# Altium schematic sheet AFE_CTRL_Logic.SchDoc: Shuttler AFE
size 420 x 297 mm; Author: G.Kasprowicz; CompanyName: WUT ISE; DrawnBy: G.Kasprowicz; Organization: WUT ISE; Address1: PW ISE; Address2: Nowowiejska 15/19 00-665 Warsaw; Address3: gkasprow@gmail.com; DocumentNumber: 3; SheetNumber: 3; SheetTotal: 6; ModifiedBy: -; CheckedDate: -; Title2: Control & logic; DivGrp: WUT ISE; Designer: G.Kasprowicz; ModifiedDate: -; ProjectName: Sensor Box
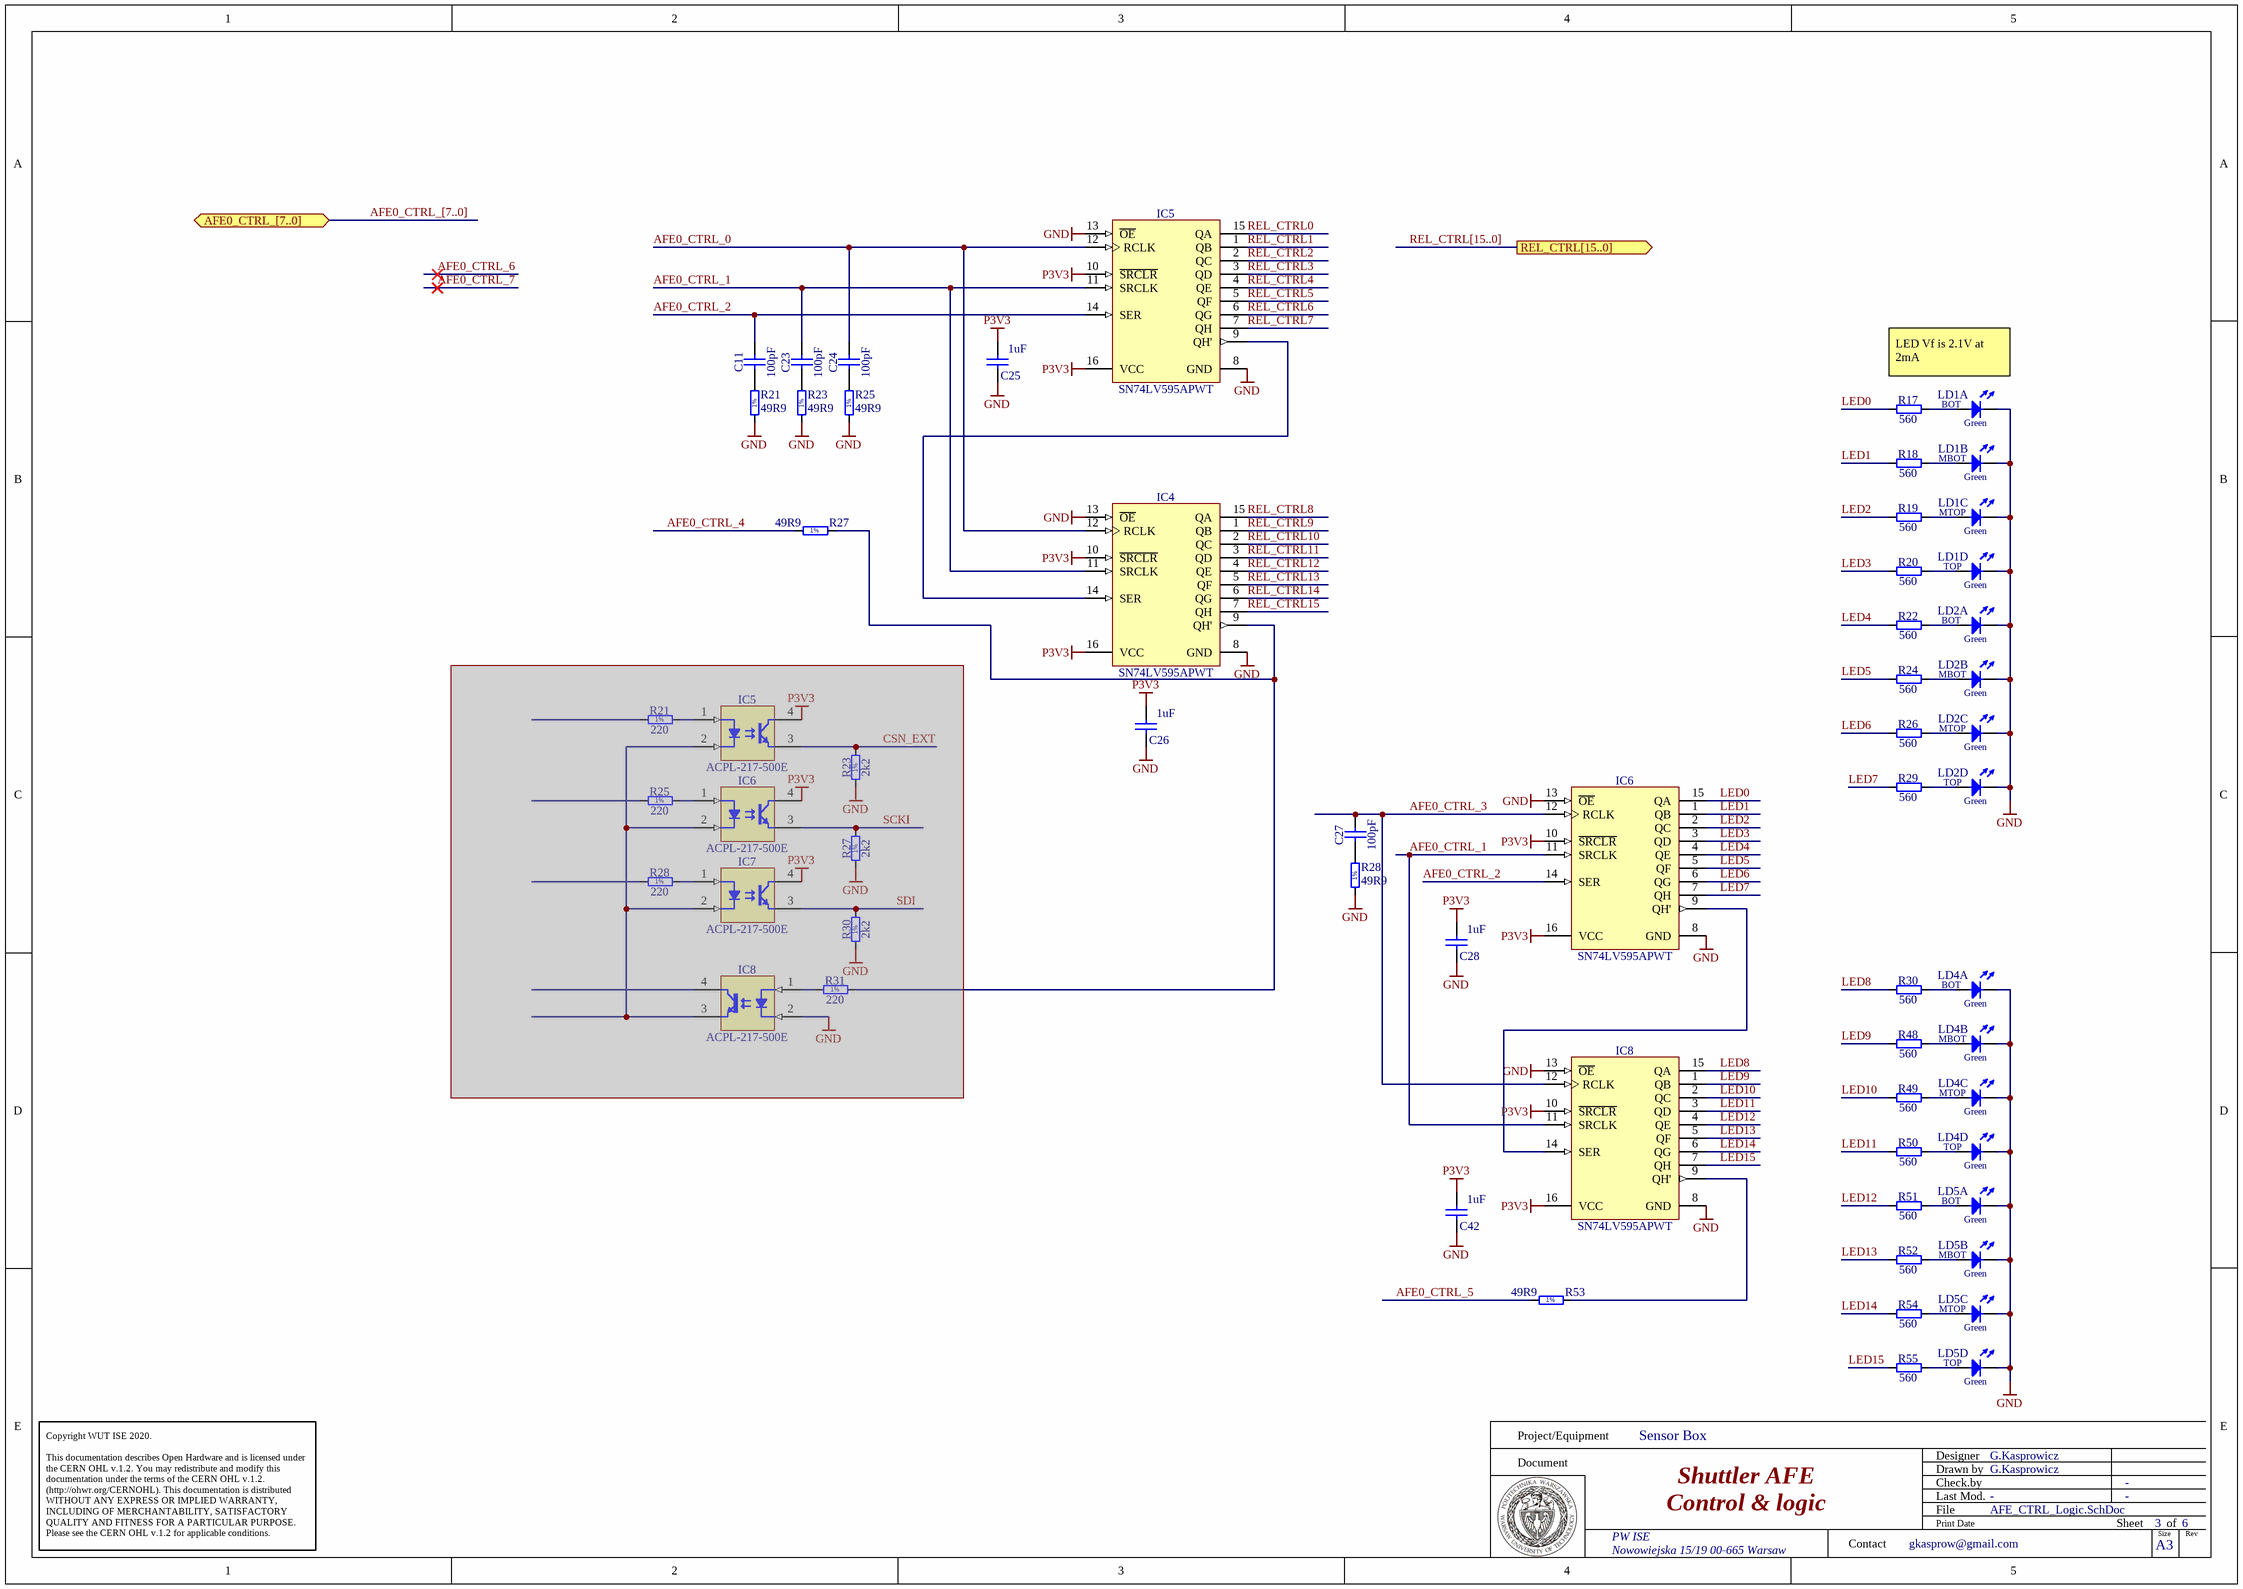
[diagram p0: AFE_CTRL_Logic.SchDoc]

## Parts
(Parts that share a designator on the sheet are numbered #1, #2 ... from top to bottom, then left to right.)
C11  100pF  [CAPC1005X55N]
C23  100pF  [CAPC1005X55N]
C24  100pF  [CAPC1005X55N]
C25  1uF  [CAPC1608X87N]
C26  1uF  [CAPC1608X87N]
C27  100pF  [CAPC1005X55N]
C28  1uF  [CAPC1608X87N]
C42  1uF  [CAPC1608X87N]
IC4  SN74LV595APWT  [SOP65P640X120-16N]
IC5#1  SN74LV595APWT  [SOP65P640X120-16N]
IC5#2  ACPL-217-500E  [SOIC127P700X242-4N]  (masked out: inside a compile mask, not in the netlist)
IC6#1  ACPL-217-500E  [SOIC127P700X242-4N]  (masked out: inside a compile mask, not in the netlist)
IC6#2  SN74LV595APWT  [SOP65P640X120-16N]
IC7  ACPL-217-500E  [SOIC127P700X242-4N]  (masked out: inside a compile mask, not in the netlist)
IC8#1  ACPL-217-500E  [SOIC127P700X242-4N]  (masked out: inside a compile mask, not in the netlist)
IC8#2  SN74LV595APWT  [SOP65P640X120-16N]
LD1  Green  [LED_BIVAR_H485CGDL]  (value not drawn)  (parts A,B,C,D of 4)
LD2  Green  [LED_BIVAR_H485CGDL]  (value not drawn)  (parts A,B,C,D of 4)
LD4  Green  [LED_BIVAR_H485CGDL]  (value not drawn)  (parts A,B,C,D of 4)
LD5  Green  [LED_BIVAR_H485CGDL]  (value not drawn)  (parts A,B,C,D of 4)
R17  560  [RESC1608X55N]
R18  560  [RESC1608X55N]
R19  560  [RESC1608X55N]
R20  560  [RESC1608X55N]
R21#1  49R9  [RESC1005X40N]
R21#2  220  [RESC1608X55N]  (masked out: inside a compile mask, not in the netlist)
R22  560  [RESC1608X55N]
R23#1  49R9  [RESC1005X40N]
R23#2  2k2  [RESC1005X40N]  (masked out: inside a compile mask, not in the netlist)
R24  560  [RESC1608X55N]
R25#1  49R9  [RESC1005X40N]
R25#2  220  [RESC1608X55N]  (masked out: inside a compile mask, not in the netlist)
R26  560  [RESC1608X55N]
R27#1  49R9  [RESC1005X40N]
R27#2  2k2  [RESC1005X40N]  (masked out: inside a compile mask, not in the netlist)
R28#1  220  [RESC1608X55N]  (masked out: inside a compile mask, not in the netlist)
R28#2  49R9  [RESC1005X40N]
R29  560  [RESC1608X55N]
R30#1  2k2  [RESC1005X40N]  (masked out: inside a compile mask, not in the netlist)
R30#2  560  [RESC1608X55N]
R31  220  [RESC1608X55N]  (masked out: inside a compile mask, not in the netlist)
R48  560  [RESC1608X55N]
R49  560  [RESC1608X55N]
R50  560  [RESC1608X55N]
R51  560  [RESC1608X55N]
R52  560  [RESC1608X55N]
R53  49R9  [RESC1005X40N]
R54  560  [RESC1608X55N]
R55  560  [RESC1608X55N]

## Ports
AFE0_CTRL_[7..0] (bidir), REL_CTRL[15..0] (out)

## Nets
GND: C25.1 C26.1 C28.1 C42.1 IC4.8(GND) IC4.13(~{OE}) IC5#1.8(GND) IC5#1.13(~{OE}) IC6#2.8(GND) IC6#2.13(~{OE}) IC8#2.8(GND) IC8#2.13(~{OE}) LD1.1(C) LD1.3(C) LD1.5(C) LD1.7(C) LD2.1(C) LD2.3(C) LD2.5(C) LD2.7(C) LD4.1(C) LD4.3(C) LD4.5(C) LD4.7(C) LD5.1(C) LD5.3(C) LD5.5(C) LD5.7(C) R21#1.1 R23#1.1 R25#1.1 R28#2.1
P3V3: C25.2 C26.2 C28.2 C42.2 IC4.10(~{SRCLR}) IC4.16(VCC) IC5#1.10(~{SRCLR}) IC5#1.16(VCC) IC6#2.10(~{SRCLR}) IC6#2.16(VCC) IC8#2.10(~{SRCLR}) IC8#2.16(VCC)
AFE0_CTRL_0: C24.2 IC4.12(RCLK) IC5#1.12(RCLK)
AFE0_CTRL_1: C23.2 IC4.11(SRCLK) IC5#1.11(SRCLK) IC6#2.11(SRCLK) IC8#2.11(SRCLK)
AFE0_CTRL_2: C11.2 IC5#1.14(SER) IC6#2.14(SER)
AFE0_CTRL_3: C27.2 IC6#2.12(RCLK) IC8#2.12(RCLK)
AFE0_CTRL_4: R27#1.1
AFE0_CTRL_5: R53.1
LED0: IC6#2.15(QA) R17.1
LED1: IC6#2.1(QB) R18.1
LED2: IC6#2.2(QC) R19.1
LED3: IC6#2.3(QD) R20.1
LED4: IC6#2.4(QE) R22.1
LED5: IC6#2.5(QF) R24.1
LED6: IC6#2.6(QG) R26.1
LED7: IC6#2.7(QH) R29.1
LED8: IC8#2.15(QA) R30#2.1
LED9: IC8#2.1(QB) R48.1
LED10: IC8#2.2(QC) R49.1
LED11: IC8#2.3(QD) R50.1
LED12: IC8#2.4(QE) R51.1
LED13: IC8#2.5(QF) R52.1
LED14: IC8#2.6(QG) R54.1
LED15: IC8#2.7(QH) R55.1
REL_CTRL0: IC5#1.15(QA)
REL_CTRL1: IC5#1.1(QB)
REL_CTRL2: IC5#1.2(QC)
REL_CTRL3: IC5#1.3(QD)
REL_CTRL4: IC5#1.4(QE)
REL_CTRL5: IC5#1.5(QF)
REL_CTRL6: IC5#1.6(QG)
REL_CTRL7: IC5#1.7(QH)
REL_CTRL8: IC4.15(QA)
REL_CTRL9: IC4.1(QB)
REL_CTRL10: IC4.2(QC)
REL_CTRL11: IC4.3(QD)
REL_CTRL12: IC4.4(QE)
REL_CTRL13: IC4.5(QF)
REL_CTRL14: IC4.6(QG)
REL_CTRL15: IC4.7(QH)
NetC11_1: C11.1 R21#1.2
NetC23_1: C23.1 R23#1.2
NetC24_1: C24.1 R25#1.2
NetC27_1: C27.1 R28#2.2
NetIC4_9: IC4.9(QH') R27#1.2
NetIC4_14: IC4.14(SER) IC5#1.9(QH')
NetIC6#2_9: IC6#2.9(QH') IC8#2.14(SER)
NetIC8#2_9: IC8#2.9(QH') R53.2
NetLD1_2: LD1.2(A) R17.2
NetLD1_4: LD1.4(A) R18.2
NetLD1_6: LD1.6(A) R19.2
NetLD1_8: LD1.8(A) R20.2
NetLD2_2: LD2.2(A) R22.2
NetLD2_4: LD2.4(A) R24.2
NetLD2_6: LD2.6(A) R26.2
NetLD2_8: LD2.8(A) R29.2
NetLD4_2: LD4.2(A) R30#2.2
NetLD4_4: LD4.4(A) R48.2
NetLD4_6: LD4.6(A) R49.2
NetLD4_8: LD4.8(A) R50.2
NetLD5_2: LD5.2(A) R51.2
NetLD5_4: LD5.4(A) R52.2
NetLD5_6: LD5.6(A) R54.2
NetLD5_8: LD5.8(A) R55.2

## Buses and harness runs
bus AFE0_CTRL_[7..0] = port AFE0_CTRL_[7..0]
bus REL_CTRL[15..0] = port REL_CTRL[15..0]

## Notes on the sheet
- LED Vf is 2.1V at 2mA
- Project/Equipment
- Document
- Designer
- Drawn by
- Check.by
- Copyright WUT ISE 2020.
  This documentation describes Open Hardware and is licensed under the CERN OHL v.1.2. You may redistribute and modify this documentation under the terms of the CERN OHL v.1.2. (http://ohwr.org/CERNOHL). This documentation is distributed WITHOUT ANY EXPRESS OR IMPLIED WARRANTY, INCLUDING OF MERCHANTABILITY, SATISFACTORY QUALITY AND FITNESS FOR A PARTICULAR PURPOSE. Please see the CERN OHL v.1.2 for applicable conditions.
- Contact
- File
- Last Mod.
- Print Date
- Sheet
- Size
- A3
- of
- Rev
- (in symbol LED_BIVAR_H485CGDL, part A) BOT
- (in symbol LED_BIVAR_H485CGDL, part B) MBOT
- (in symbol LED_BIVAR_H485CGDL, part C) MTOP
- (in symbol LED_BIVAR_H485CGDL, part D) TOP
- (in symbol R0402_2K2_1%_0.0625W_100PPM) 1%
- (in symbol R0402_49R9_1%_0.0625W_100PPM) 1%
- (in symbol R0603_220R_1%_0.1W_100PPM) 1%

## Library data of the parts
C11 C23 C24 C27 = CC0402_100PF_50V_5%_C0G: Non-polarised capacitor; Part Description: SMD Multilayer Chip Ceramic Capacitor; Manufacturer: GENERIC; Manufacturer1 Part Number: C0402C101J5GACTU; Voltage: 50V; TC: C0G/NP0; Tolerance: ±5%; Part Number: CC0402_100PF_50V_5%_C0G; Component Kind: Standard; Component Type: Standard; Pin Count: 2; Value: 100pF; Status: Preferred; Manufacturer Part Number: CC0402_100PF_50V_5%_C0G; Case: 0402; Mounted: Yes; Socket: No; SMD: Yes; Sense: No; Manufacturer1 Example: KEMET; Manufacturer1 ComponentHeight: 0.55mm; HelpURL: \\cern.ch\dfs\Applications\Altium\Datasheets\CC0402_C0G_KEMET_(Commercial Grade).pdf; Author: CERN DEM JLC; CreateDate: 03.12.2007; LatestRevisionDate: 22.04.2015
C25 C26 C28 C42 = CC0603_1UF_16V_10%_X7R: Non-polarised capacitor; Part Description: SMD Multilayer Chip Ceramic Capacitor; Manufacturer: GENERIC; Manufacturer1 Part Number: 223878615663; Voltage: 16V; TC: X7R; Tolerance: ±10%; Part Number: CC0603_1UF_16V_10%_X7R; Component Kind: Standard; Component Type: Standard; Pin Count: 2; Value: 1uF; Status: None; Manufacturer Part Number: CC0603_1UF_16V_10%_X7R; Case: 0603; Mounted: Yes; Socket: No; SMD: Yes; Sense: No; Manufacturer1 Example: YAGEO PHYCOMP; Manufacturer1 ComponentHeight: 0.9mm; HelpURL: \\cern.ch\dfs\Applications\Altium\Datasheets\CC0603_X7R_PHYCOMP.pdf; Author: CERN DEM JLC; CreateDate: 03.12.2007; LatestRevisionDate: 17.04.2015
IC4 IC5#1 IC6#2 IC8#2 = SN74LV595APWT: 8-Bit Shift Register With 3-State Output Register; Manufacturer: TEXAS INSTRUMENTS; PressFit: No; Bonding: No; Part Number: SN74LV595APWT; Component Kind: Standard; Component Type: Standard; Device: SN74LV595APWT; PackageDescription: SOP, 0.65mm pitch; 16 pin, 4.40mm W X 5.00mm L X 1.20mm H body IPC Medium Density; Part Description: 8-Bit Shift Register With 3-State Output Register; Manufacturer Part Number: SN74LV595APWT; Pin Count: 16; Case: TSSOP16; Mounted: Yes; Socket: No; SMD: Yes; Sense: No; ComponentHeight: 1.2mm; Author: CERN DEM JLC; HelpURL: \\cern.ch\dfs\Applications\Altium\Datasheets\SN74LV595APWT.pdf; CreateDate: 10.05.2012; LatestRevisionDate: 10.05.2012
IC5#2 IC6#1 IC7 IC8#1 = ACPL-217-500E: Single Optocoupler; Part Description: DC Input, Half-Pitch Phototransistor Optocoupler; Manufacturer: AVAGO TECHNOLOGIES; PressFit: No; Bonding: No; Part Number: ACPL-217-500E; Component Kind: Standard; Component Type: Standard; Device: ACPL-217-500E; PackageDescription: SOIC, 1.27mm, pitch; 4 pin, 2.60mm W X 4.40mm L X 2.42mm H body, IPC Medium Density; Status: Not Recommended; Manufacturer Part Number: ACPL-217-500E; Pin Count: 4; Case: SOIC4; Mounted: Yes; Socket: No; SMD: Yes; Sense: No; ComponentHeight: 2.42mm; HelpURL: \\cern.ch\dfs\Applications\Altium\Datasheets\ACPL-217-500E.pdf; Author: CERN DEM JLC; CreateDate: 11.11.2014; LatestRevisionDate: 11.11.2014
LD1 LD2 LD4 LD5 = LED_BIVAR_H485CGDL: LED x4 Green 1C2A-BOT_3C4A_5C6A_7C8A-TOP; Part Description: Quad-Level 2mm Green LED, PCB Edge Mounting; Manufacturer: BIVAR; PressFit: No; Bonding: No; Part Number: LED_BIVAR_H485CGDL; Component Kind: Standard; Component Type: Standard; Color: Green; PackageDescription: Quad-Level 2mm Green, PCB Edge Mounting  BIVAR H485CHDL; Manufacturer Part Number: H485CGDL; Pin Count: 8; Mounted: Yes; Socket: No; SMD: No; Sense: No; ComponentHeight: 11.3mm; HelpURL: \\cern.ch\dfs\Applications\Altium\Datasheets\LED_BIVAR_H485CGDL.pdf; Author: CERN DEM JLC; CreateDate: 04.06.2012; LatestRevisionDate: 04.06.2012
R17-R20 R22 R24 R26 R29 R30#2 R48-R52 R54 R55 = R0603_560R_1%_0.1W_100PPM: Resistor - 1%; Part Description: General Purpose Thick Film Chip Resistor; Manufacturer: GENERIC; Manufacturer1 Part Number: NRC06F5600TRF; Power: 0.1W; TC: ±100ppm/°C; PressFit: No; Part Number: R0603_560R_1%_0.1W_100PPM; Component Kind: Standard; Component Type: Standard; Pin Count: 2; Value: 560; Status: Preferred; Tolerance: ±1%; Manufacturer Part Number: R0603_560R_1%_0.1W_100PPM; Case: 0603; Mounted: Yes; Sense: No; Socket: No; SMD: Yes; Manufacturer1 Example: NIC COMPONENT; Manufacturer1 ComponentHeight: 0.55mm; HelpURL: \\cern.ch\dfs\Applications\Altium\Datasheets\R0603_NIC_NRC.pdf; Author: CERN DEM JLC; CreateDate: 03.12.2007; LatestRevisionDate: 13.03.2008
R21#1 R23#1 R25#1 R27#1 R28#2 R53 = R0402_49R9_1%_0.0625W_100PPM: Resistor - 1%; Part Description: General Purpose Thick Film Chip Resistor; Manufacturer: GENERIC; Manufacturer1 Part Number: 232270674999L or RC0402FR-0749R9L; TC: ±100ppm/°C; PressFit: No; Part Number: R0402_49R9_1%_0.0625W_100PPM; Component Kind: Standard; Component Type: Standard; Pin Count: 2; Value: 49R9; Status: Not Recommended; Power: 0.0625W; Tolerance: ±1%; Manufacturer Part Number: R0402_49R9_1%_0.0625W_100PPM; Case: 0402; Mounted: Yes; Sense: No; Socket: No; SMD: Yes; Manufacturer1 Example: YAGEO PHYCOMP; Manufacturer1 ComponentHeight: 0.4mm; HelpURL: \\cern.ch\dfs\Applications\Altium\Datasheets\R0402_Phycomp_RC0402.pdf; Author: CERN DEM JLC; CreateDate: 24.10.2012; LatestRevisionDate: 24.10.2012
R21#2 R25#2 R28#1 R31 = R0603_220R_1%_0.1W_100PPM: Resistor - 1%; Part Description: General Purpose Thick Film Chip Resistor; Manufacturer: GENERIC; Manufacturer1 Part Number: NRC06F2200TRF; Power: 0.1W; TC: ±100ppm/°C; Part Number: R0603_220R_1%_0.1W_100PPM; Component Kind: Standard; Component Type: Standard; Pin Count: 2; Value: 220; Status: Preferred; Tolerance: ±1%; Manufacturer Part Number: R0603_220R_1%_0.1W_100PPM; Case: 0603; Mounted: Yes; Sense: No; Socket: No; SMD: Yes; Manufacturer1 Example: NIC COMPONENT; Manufacturer1 ComponentHeight: 0.55mm; HelpURL: \\cern.ch\dfs\Applications\Altium\Datasheets\R0603_NIC_NRC.pdf; Author: CERN DEM JLC; CreateDate: 03.12.2007; LatestRevisionDate: 13.03.2008
R23#2 R27#2 R30#1 = R0402_2K2_1%_0.0625W_100PPM: Resistor - 1%; Part Description: General Purpose Thick Film Chip Resistor; Manufacturer: GENERIC; Manufacturer1 Part Number: 232270672202L; TC: ±100ppm/°C; PressFit: No; Part Number: R0402_2K2_1%_0.0625W_100PPM; Component Kind: Standard; Component Type: Standard; Pin Count: 2; Value: 2k2; Status: Not Recommended; Power: 0.0625W; Tolerance: ±1%; Manufacturer Part Number: R0402_2K2_1%_0.0625W_100PPM; Case: 0402; Mounted: Yes; Sense: No; Socket: No; SMD: Yes; Manufacturer1 Example: YAGEO PHYCOMP; Manufacturer1 ComponentHeight: 0.4mm; HelpURL: \\cern.ch\dfs\Applications\Altium\Datasheets\R0402_Phycomp_RC0402.pdf; Author: CERN DEM JLC; CreateDate: 03.12.2007; LatestRevisionDate: 17.10.2012